# Altium schematic sheet CoG_DE0.SchDoc
size A3; Author: Audran; CompanyName: Goldorak; Address1: Electrolab; Address2: 52 rue Paul Lescop; Address3: 92000 Nanterre; ProjectName: Cartes_2017
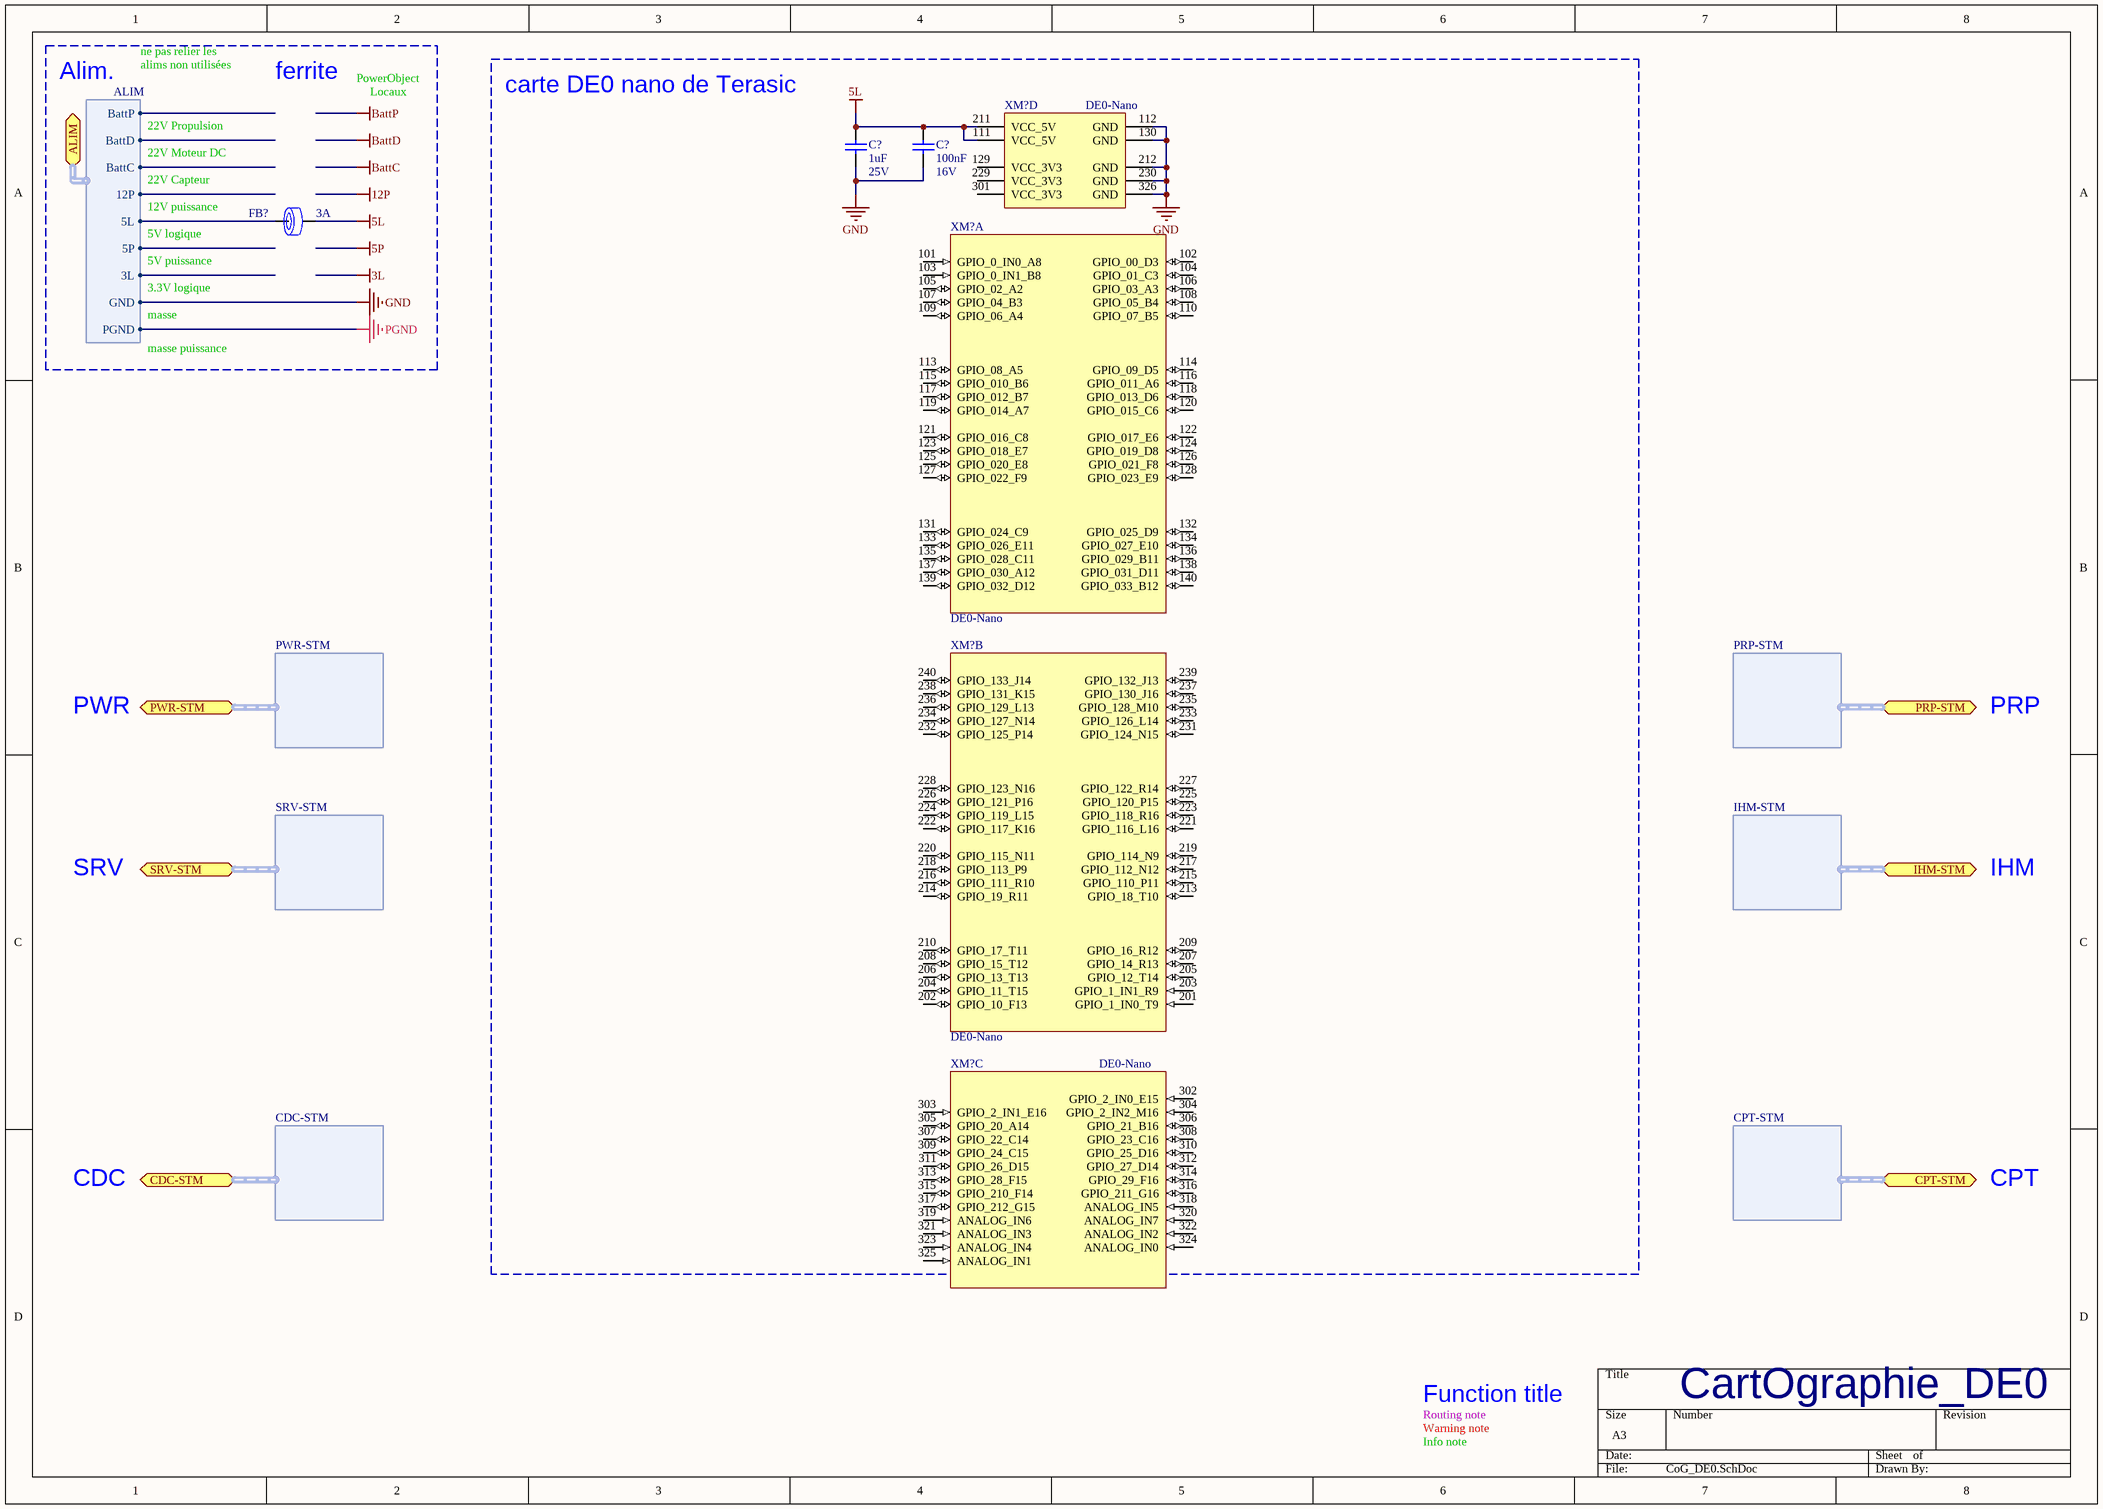
[diagram p0: CoG_DE0.SchDoc]

## Parts
(Parts that share a designator on the sheet are numbered #1, #2 ... from top to bottom, then left to right.)
C?#1  1uF  RatedVoltage: 25V  [WCAP-CSGP_0603, 1.6x0.8x0.8]
C?#2  100nF  RatedVoltage: 16V  [WCAP-CSGP_0402, 1x0.5x0.5]
FB?  RatedCurrent: 3A  [WE-CBF_0805_High Current]  (hidden comment: 742792023)
XM?#1  DE0-Nano  [DE0-NANO_SMT]  (part D of 4)
XM?#2  DE0-Nano  [DE0-NANO_SMT]  (part A of 4)
XM?#3  DE0-Nano  [DE0-NANO_SMT]  (part B of 4)
XM?#4  DE0-Nano  [DE0-NANO_SMT]  (part C of 4)

## Blocks framed on the sheet
carte DE0 nano de Terasic: C?#1 C?#2 XM?#1-XM?#4

## Ports
ALIM (harness ALIM), CDC-STM (harness CDC-STM), CPT-STM (harness CPT-STM), IHM-STM (harness IHM-STM), PRP-STM (harness PRP-STM), PWR-STM (harness PWR-STM), SRV-STM (harness SRV-STM)

## Harnesses
PRP-STM: 
IHM-STM: 
CPT-STM: 
PWR-STM: 
SRV-STM: 
CDC-STM: 
ALIM: BattP, BattD, BattC, 12P, 5L, 5P, 3L, GND, PGND

## Nets
5L: C?#1.1 C?#2.2 FB?.2 XM?#1.111(VCC_5V) XM?#1.211(VCC_5V)
GND: C?#1.2 C?#2.1 XM?#1.112(GND) XM?#1.130(GND) XM?#1.212(GND) XM?#1.230(GND) XM?#1.326(GND) ; port ALIM.GND
PGND: port ALIM.PGND
NetFB?_1: FB?.1 ; port ALIM.5L

Not connected (* = marked no-connect by the designer): XM?#1 129(VCC_3V3) 229(VCC_3V3) 301(VCC_3V3); XM?#2 101(GPIO_0_IN0_A8) 102(GPIO_00_D3) 103(GPIO_0_IN1_B8) 104(GPIO_01_C3) 105(GPIO_02_A2) 106(GPIO_03_A3) 107(GPIO_04_B3) 108(GPIO_05_B4) 109(GPIO_06_A4) 110(GPIO_07_B5) 113(GPIO_08_A5) 114(GPIO_09_D5) 115(GPIO_010_B6) 116(GPIO_011_A6) 117(GPIO_012_B7) 118(GPIO_013_D6) 119(GPIO_014_A7) 120(GPIO_015_C6) 121(GPIO_016_C8) 122(GPIO_017_E6) 123(GPIO_018_E7) 124(GPIO_019_D8) 125(GPIO_020_E8) 126(GPIO_021_F8) 127(GPIO_022_F9) 128(GPIO_023_E9) 131(GPIO_024_C9) 132(GPIO_025_D9) 133(GPIO_026_E11) 134(GPIO_027_E10) 135(GPIO_028_C11) 136(GPIO_029_B11) 137(GPIO_030_A12) 138(GPIO_031_D11) 139(GPIO_032_D12) 140(GPIO_033_B12); XM?#3 201(GPIO_1_IN0_T9) 202(GPIO_10_F13) 203(GPIO_1_IN1_R9) 204(GPIO_11_T15) 205(GPIO_12_T14) 206(GPIO_13_T13) 207(GPIO_14_R13) 208(GPIO_15_T12) 209(GPIO_16_R12) 210(GPIO_17_T11) 213(GPIO_18_T10) 214(GPIO_19_R11) 215(GPIO_110_P11) 216(GPIO_111_R10) 217(GPIO_112_N12) 218(GPIO_113_P9) 219(GPIO_114_N9) 220(GPIO_115_N11) 221(GPIO_116_L16) 222(GPIO_117_K16) 223(GPIO_118_R16) 224(GPIO_119_L15) 225(GPIO_120_P15) 226(GPIO_121_P16) 227(GPIO_122_R14) 228(GPIO_123_N16) 231(GPIO_124_N15) 232(GPIO_125_P14) 233(GPIO_126_L14) 234(GPIO_127_N14) 235(GPIO_128_M10) 236(GPIO_129_L13) 237(GPIO_130_J16) 238(GPIO_131_K15) 239(GPIO_132_J13) 240(GPIO_133_J14); XM?#4 302(GPIO_2_IN0_E15) 303(GPIO_2_IN1_E16) 304(GPIO_2_IN2_M16) 305(GPIO_20_A14) 306(GPIO_21_B16) 307(GPIO_22_C14) 308(GPIO_23_C16) 309(GPIO_24_C15) 310(GPIO_25_D16) 311(GPIO_26_D15) 312(GPIO_27_D14) 313(GPIO_28_F15) 314(GPIO_29_F16) 315(GPIO_210_F14) 316(GPIO_211_G16) 317(GPIO_212_G15) 318(ANALOG_IN5) 319(ANALOG_IN6) 320(ANALOG_IN7) 321(ANALOG_IN3) 322(ANALOG_IN2) 323(ANALOG_IN4) 324(ANALOG_IN0) 325(ANALOG_IN1)

## Notes on the sheet
- Alim.
- ne pas relier les
- alims non utilisées
- ferrite
- PowerObject
- Locaux
- 22V Propulsion
- 22V Moteur DC
- 22V Capteur
- 5V logique
- 12V puissance
- 5V puissance
- 3.3V logique
- masse
- masse puissance
- PWR
- PRP
- SRV
- IHM
- CDC
- CPT
- Routing note
- Warning note
- Info note
- Function title
- CartOgraphie_DE0

## Library data of the parts
C?#1 = WCAP-CSGP, 885012206076: CAP CER 1uF 25V X7R 0603; Manufacturer: Wurth Elektronik; PublishedDate: Aug 2016; ComponentLink1Description: Manufacturer; ComponentLink1URL: http://www.we-online.de; ComponentLink2Description: Datasheet; ComponentLink2URL: http://katalog.we-online.com/pbs/datasheet/885012206076.pdf; Manufacturer Part Number: 885012206076; Value: 1uF; Size: 0603; CeramicType: X7R
C?#2 = WCAP-CSGP, 885012205037: CAP CER 100nF 16V X7R 0402; Manufacturer: Wurth Elektronik; PublishedDate: Aug 2016; ComponentLink1Description: Manufacturer; ComponentLink1URL: http://www.we-online.de; ComponentLink2Description: Datasheet; ComponentLink2URL: http://katalog.we-online.com/pbs/datasheet/885012205037.pdf; Value: 100nF; Size: 0402; CeramicType: X7R; Manufacturer Part Number: 885012205037
FB? = WE-CBF, 742792023: Ferrite Bead 120ohm 0805 max3.0A; Manufacturer: Wurth Elektronik; Value: 120Ω; Type: High Current; PublishedDate: Aug 2016; ComponentLink1Description: Manufacturer; ComponentLink1URL: http://www.we-online.de; ComponentLink2Description: Datasheet; ComponentLink2URL: http://katalog.we-online.de/pbs/datasheet/742792023.pdf; Manufacturer Part Number: 742792023; Size: 0805
XM?#1-XM?#4 = DE0-NANO_CMS_FULL: carte DE0-Nano modifié pour embase CMS (garde 10mm); Manufacturer: TERASIC; Supplier Part Number 1: 2x 61004021821, 1x 61002621821; Supplier 1: Wurth Elektronik; Manufacturer Part Number: DE0-Nano; ComponentLink1URL: http://www.terasic.com.tw/cgi-bin/page/archive.pl?Language=English&CategoryNo=165&No=593&PartNo=1; ComponentLink1Description: Product page